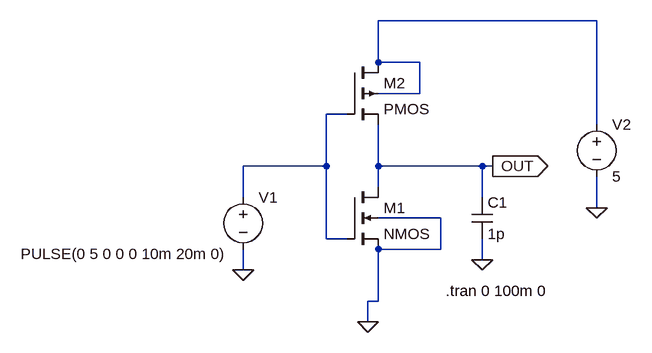
[diagram p0: schematic CMOS_Inverter.asc.asc]
CMOS_Inverter.asc.asc, the LTspice schematic file:
Version 4.1
SHEET 1 880 680
WIRE 496 -112 160 -112
WIRE 160 -48 160 -112
WIRE 224 -48 160 -48
WIRE 224 0 224 -48
WIRE 224 0 160 0
WIRE 112 32 80 32
WIRE 496 48 496 -112
WIRE 80 112 80 32
WIRE 80 112 -48 112
WIRE 160 112 160 48
WIRE 320 112 160 112
WIRE 336 112 320 112
WIRE 160 144 160 112
WIRE -48 160 -48 112
WIRE 320 160 320 112
WIRE 496 176 496 128
WIRE 256 192 160 192
WIRE 80 224 80 112
WIRE 112 224 80 224
WIRE 256 240 256 192
WIRE 256 240 160 240
WIRE 320 256 320 224
WIRE -48 272 -48 240
WIRE 160 320 160 240
WIRE 160 320 144 320
WIRE 144 352 144 320
FLAG 144 352 0
FLAG 336 112 OUT
IOPIN 336 112 Out
FLAG -48 272 0
FLAG 496 176 0
FLAG 320 256 0
SYMBOL pmos4 112 -48 R0
SYMATTR InstName M2
SYMBOL nmos4 112 144 R0
SYMATTR InstName M1
SYMBOL voltage -48 144 R0
WINDOW 3 -342 103 Left 2
WINDOW 123 0 0 Left 0
WINDOW 39 0 0 Left 0
SYMATTR InstName V1
SYMATTR Value PULSE(0 5 0 0 0 10m 20m 0)
SYMBOL voltage 496 32 R0
SYMATTR InstName V2
SYMATTR Value 5
SYMBOL cap 304 160 R0
SYMATTR InstName C1
SYMATTR Value 1p
TEXT 264 304 Left 2 !.tran 0 100m 0

The netlist it stands for:
* CMOS_Inverter.asc.asc
M2 N001 N002 OUT N001 PMOS
M1 OUT N002 0 0 NMOS
V1 N002 0 PULSE(0 5 0 0 0 10m 20m 0)
V2 N001 0 5
C1 OUT 0 1p
.model NMOS NMOS
.model PMOS PMOS
.lib standard.mos
.tran 0 100m 0
.backanno
.end